# EAGLE design due_can_shield_v11 (EAGLE 6.1)
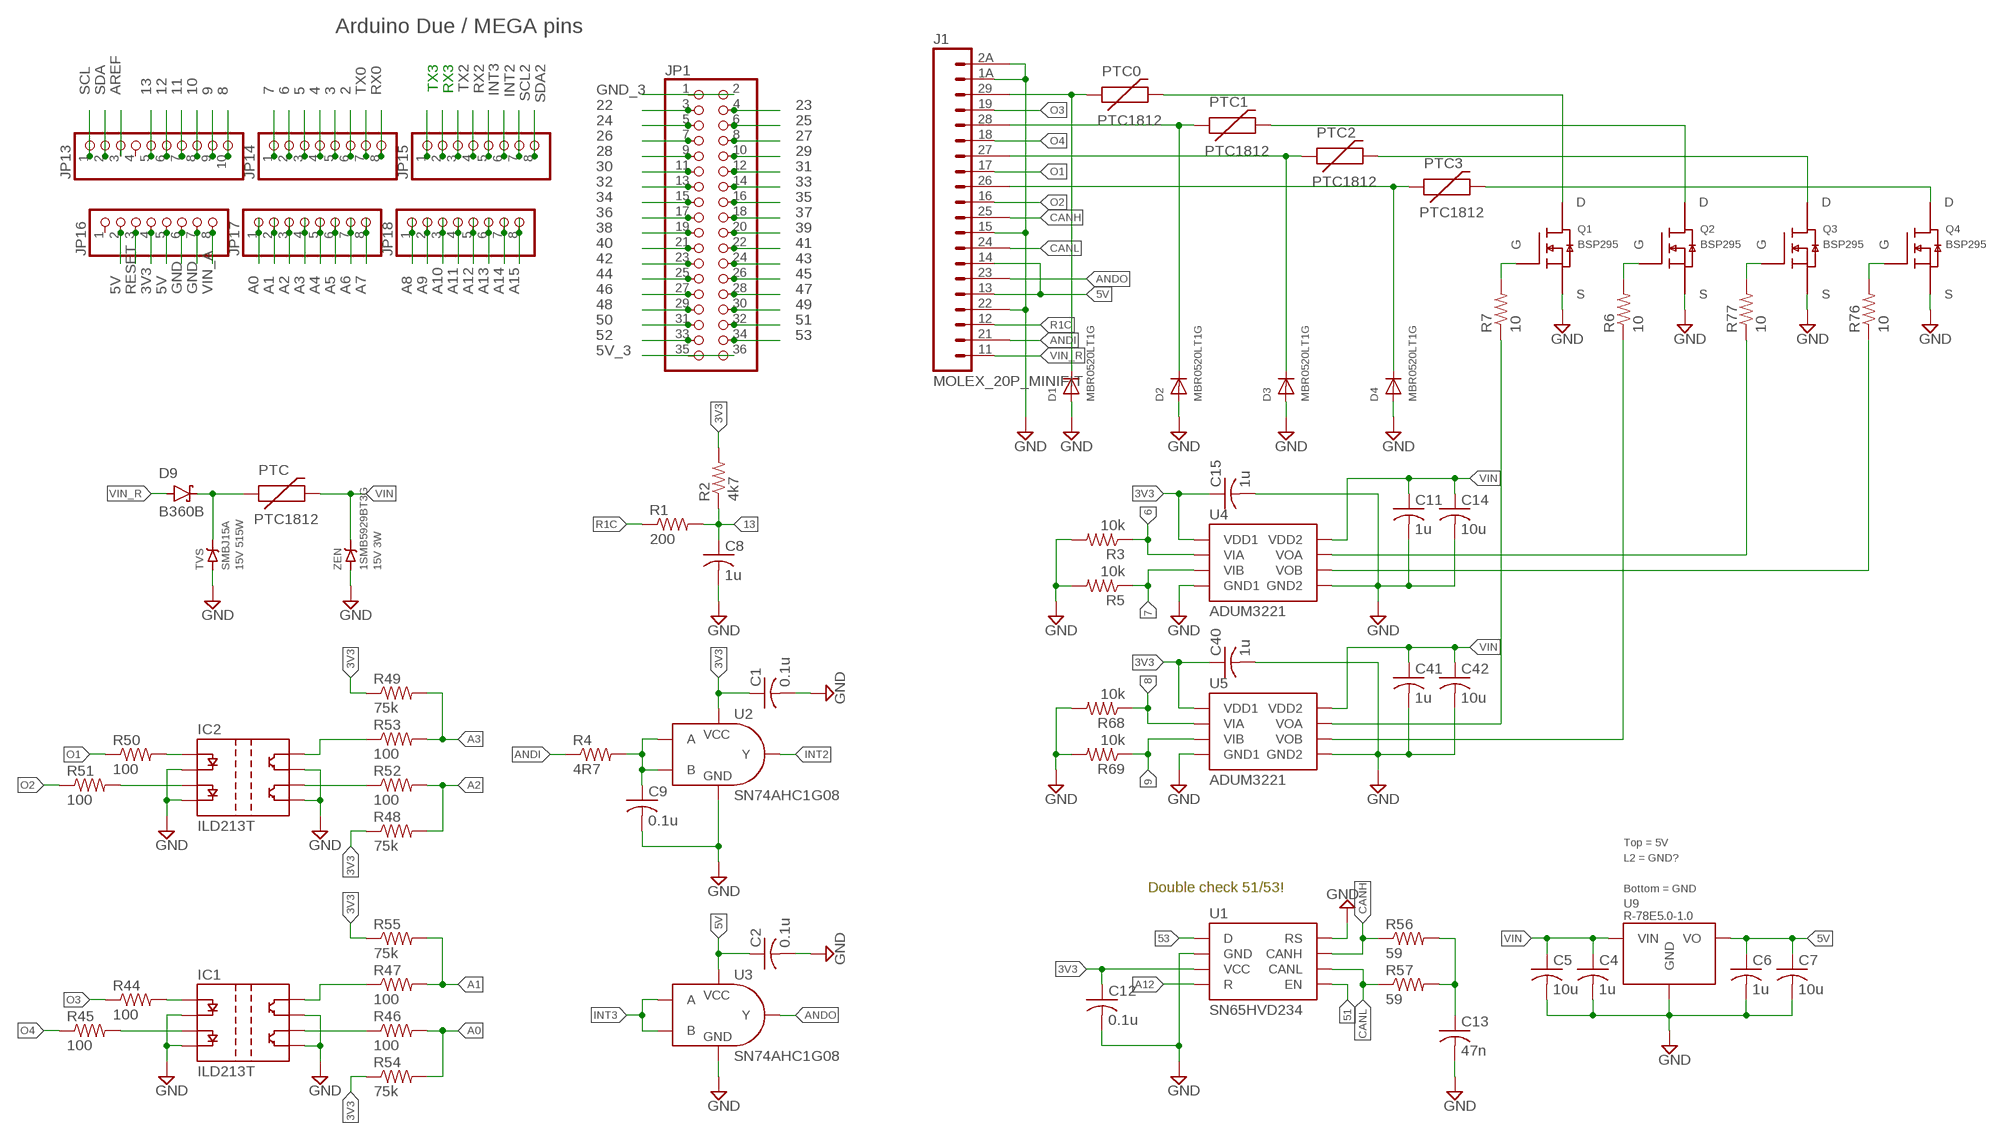
[diagram p0: schematic, sheet 1]

## Parts
C1  0.1u  C-USC0603  [C0603]
C2  0.1u  C-USC0603  [C0603]
C4  1u  C-USC0805  [C0805]
C5  10u  C-USC0805  [C0805]
C6  1u  C-USC0805  [C0805]
C7  10u  C-USC0805  [C0805]
C8  1u  C-USC0805  [C0805]
C9  0.1u  C-USC0603  [C0603]
C11  1u  C-USC0805  [C0805]
C12  0.1u  C-USC0603  [C0603]
C13  47n  C-USC0805  [C0805]
C14  10u  C-USC0805  [C0805]
C15  1u  C-USC0805  [C0805]
C40  1u  C-USC0805  [C0805]
C41  1u  C-USC0805  [C0805]
C42  10u  C-USC0805  [C0805]
D1  MBR0520LT1G  DIODESOD-123  [SOD-123]
D2  MBR0520LT1G  DIODESOD-123  [SOD-123]
D3  MBR0520LT1G  DIODESOD-123  [SOD-123]
D4  MBR0520LT1G  DIODESOD-123  [SOD-123]
D9  B360B  DIODE_SCHOTTKYSMB  [DO-214AA_SMB]
IC1  ILD213T  [8-SOIC]
IC2  ILD213T  [8-SOIC]
J1  MOLEX_20P_MINIFIT  [MOLEX_20P_MINIFIT]
JP1  PINHD-2X18  [2X18]
JP13  PINHD-1X10  [1X10]
JP14  PINHD-1X8  [1X08]
JP15  PINHD-1X8  [1X08]
JP16  PINHD-1X8  [1X08]
JP17  PINHD-1X8  [1X08]
JP18  PINHD-1X8  [1X08]
PTC  PTC1812  [1812]
PTC0  PTC1812  [1812]
PTC1  PTC1812  [1812]
PTC2  PTC1812  [1812]
PTC3  PTC1812  [1812]
Q1  BSP295  N-MOSFETSOT223  [SOT223]
Q2  BSP295  N-MOSFETSOT223  [SOT223]
Q3  BSP295  N-MOSFETSOT223  [SOT223]
Q4  BSP295  N-MOSFETSOT223  [SOT223]
R1  200  R-US_R0603  [R0603]
R2  4k7  R-US_R0603  [R0603]
R3  10k  R-US_R0402  [R0402]
R4  4R7  R-US_R0603  [R0603]
R5  10k  R-US_R0402  [R0402]
R6  10  R-US_R0402  [R0402]
R7  10  R-US_R0402  [R0402]
R44  100  R-US_R0402  [R0402]
R45  100  R-US_R0402  [R0402]
R46  100  R-US_R0402  [R0402]
R47  100  R-US_R0402  [R0402]
R48  75k  R-US_R0402  [R0402]
R49  75k  R-US_R0402  [R0402]
R50  100  R-US_R0402  [R0402]
R51  100  R-US_R0402  [R0402]
R52  100  R-US_R0402  [R0402]
R53  100  R-US_R0402  [R0402]
R54  75k  R-US_R0402  [R0402]
R55  75k  R-US_R0402  [R0402]
R56  59  R-US_R0805  [R0805]
R57  59  R-US_R0805  [R0805]
R68  10k  R-US_R0402  [R0402]
R69  10k  R-US_R0402  [R0402]
R76  10  R-US_R0402  [R0402]
R77  10  R-US_R0402  [R0402]
TVS  SMBJ15A  ZENERSMB  [DO-214AA_SMB]
U1  SN65HVD234  [8-SOIC]
U2  SN74AHC1G08  [SC70-5]
U3  SN74AHC1G08  [SC70-5]
U4  ADUM3221  [8-SOIC]
U5  ADUM3221  [8-SOIC]
U9  R-78E5.0-1.0  [R-78E5.0-1.0]
ZEN  1SMB5929BT3G  ZENERSMB  [DO-214AA_SMB]

## Nets
2: JP14.6
3: JP14.5
3V3: C1.1 C12.1 C15.1 C40.1 JP16.4 R2.2 R48.1 R49.1 R54.1 R55.1 U1.3(VCC) U2.5(VCC) U4.1(VDD1) U5.1(VDD1)
4: JP14.4
5: JP14.3
5V: C2.1 C6.1 C7.1 J1.13 J1.14 JP16.2 JP16.5 U3.5(VCC) U9.3-OUT(VO)
5V_3: JP1.36
6: JP14.2 R3.1 U4.2(VIA)
7: JP14.1 R5.1 U4.3(VIB)
8: JP13.10 R68.1 U5.2(VIA)
9: JP13.9 R69.1 U5.3(VIB)
10: JP13.8
11: JP13.7
12: JP13.6
13: C8.1 JP13.5 R1.2 R2.1
22: JP1.3
23: JP1.4
24: JP1.5
25: JP1.6
26: JP1.7
27: JP1.8
28: JP1.9
29: JP1.10
30: JP1.11
31: JP1.12
32: JP1.13
33: JP1.14
34: JP1.15
35: JP1.16
36: JP1.17
37: JP1.18
38: JP1.19
39: JP1.20
40: JP1.21
41: JP1.22
42: JP1.23
43: JP1.24
44: JP1.25
45: JP1.26
46: JP1.27
47: JP1.28
48: JP1.29
49: JP1.30
50: JP1.31
51: JP1.32 U1.5(EN)
52: JP1.33
53: JP1.34 U1.1(D)
A0: JP17.1 R46.2 R54.2
A1: JP17.2 R47.2 R55.2
A2: JP17.3 R48.2 R52.2
A3: JP17.4 R49.2 R53.2
A4: JP17.5
A5: JP17.6
A6: JP17.7
A7: JP17.8
A8: JP18.1
A9: JP18.2
A10: JP18.3
A11: JP18.4
A12: JP18.5 U1.4(R)
A13: JP18.6
A14: JP18.7
A15: JP18.8
ANDI: J1.21 R4.1
ANDO: J1.23 U3.4(Y)
AREF: JP13.3
CANH: J1.25 R56.1 U1.7(CANH)
CANL: J1.24 R57.1 U1.6(CANL)
GND: C1.2 C2.2 C4.2 C5.2 C6.2 C7.2 C8.2 C9.2 C11.2 C12.2 C13.2 C14.2 C15.2 C40.2 C41.2 C42.2 D1.A D2.A D3.A D4.A IC1.2(K1) IC1.4(K2) IC1.5(E2) IC1.7(E1) IC2.2(K1) IC2.4(K2) IC2.5(E2) IC2.7(E1) J1.1A J1.2A J1.15 J1.22 JP16.6 JP16.7 Q1.3(S) Q2.3(S) Q3.3(S) Q4.3(S) R3.2 R5.2 R68.2 R69.2 TVS.A U1.2(GND) U1.8(RS) U2.3(GND) U3.3(GND) U4.4(GND1) U4.5(GND2) U5.4(GND1) U5.5(GND2) U9.2-GND(GND) ZEN.A
GND_3: JP1.2
INT2: JP15.6 U2.4(Y)
INT3: JP15.5 U3.1(A) U3.2(B)
N$1: D1.C J1.29 PTC0.1
N$2: D2.C J1.28 PTC1.1
N$3: D3.C J1.27 PTC2.1
N$4: D4.C J1.26 PTC3.1
N$5: R77.1 U4.7(VOA)
N$6: R76.1 U4.6(VOB)
N$7: PTC0.2 Q1.2(D) Q1.4(D)
N$8: PTC1.2 Q2.2(D) Q2.4(D)
N$9: PTC2.2 Q3.2(D) Q3.4(D)
N$10: IC2.1(A1) R50.2
N$11: PTC3.2 Q4.2(D) Q4.4(D)
N$12: D9.K(CATHODE) PTC.1 TVS.K
N$13: Q1.1(G) R7.2
N$14: Q2.1(G) R6.2
N$15: Q3.1(G) R77.2
N$16: Q4.1(G) R76.2
N$17: R7.1 U5.7(VOA)
N$18: R6.1 U5.6(VOB)
N$19: IC2.3(A2) R51.2
N$20: C13.1 R56.2 R57.2
N$21: IC1.1(A1) R44.2
N$22: IC1.3(A2) R45.2
N$23: IC2.8(C1) R53.1
N$24: IC2.6(C2) R52.1
N$25: IC1.8(C1) R47.1
N$26: IC1.6(C2) R46.1
N$27: C9.1 R4.2 U2.1(A) U2.2(B)
O1: J1.17 R50.1
O2: J1.16 R51.1
O3: J1.19 R44.1
O4: J1.18 R45.1
R1C: J1.12 R1.1
RESET: JP16.3
RX0: JP14.8
RX2: JP15.4
RX3: JP15.2
SCL: JP13.1
SCL2: JP15.7
SDA: JP13.2
SDA2: JP15.8
TX0: JP14.7
TX2: JP15.3
TX3: JP15.1
VIN: C4.1 C5.1 C11.1 C14.1 C41.1 C42.1 PTC.2 U4.8(VDD2) U5.8(VDD2) U9.1-IN(VIN) ZEN.K
VIN_A: JP16.8
VIN_R: D9.A(ANODE) J1.11
Unconnected: JP1.1 JP1.35 JP13.4 JP16.1

## Notes on the sheet
- Arduino Due / MEGA pins
- 15V 515W | 15V 3W
- Top = 5V
- L2 = GND?
- Double check 51/53! | Bottom = GND

## Library data of the parts
C1 C2 C4-C9 C11-C15 C40-C42 = resistor:C-US: CAPACITOR, American symbol
D1-D4 = adafruit:DIODE: Diode SMADIODE - SMA Surface Mount Package 20V 1A Schottky Diode Digikey: 641-1014-6-ND DO-1N4148 - Through Hole Small Current Diode SOD-123 20V 1 A (.5mV Vf) Schottky Diode - Digikey: MBRX120TPMSCT-ND SOD-323 10V 570mA (.38mV Vf, 3ns) Schottky Diode - Digikey: ZLLS410CT-ND SOD-523 30V 30mA Schottky Diode (RB751S-40TE61) - Digikey: RB751S-40TE61CT-ND SOT23-R/W - SOT23 Package (R = Solder Paste/Reflow Ovens, W = Hand-Soldering) BAT54Film 40V 300mA - Digikey: 497-7162-1-ND
D9 = custom:DIODE_SCHOTTKY: 40V 1A 500mV @1A
IC1 IC2 = custom:ILD213T: Optocoupler Dual Phototransistor Output 4kV 70V 30mA Max
J1 = custom:MOLEX_20P_MINIFIT: Molex 353182020
JP1 = pinhead:PINHD-2X18: PIN HEADER
JP13 = pinhead:PINHD-1X10: PIN HEADER
JP14-JP18 = pinhead:PINHD-1X8: PIN HEADER
PTC PTC0 PTC1-PTC3 = custom:PTC
Q1-Q4 = custom:N-MOSFET: N-Channel MOSFET - HM2302A, Vds 20V, Id 2.9A, Rdson 59mOhm @2.5Vgs, Marking Code = A2SHB
R1-R7 R44-R57 R68 R69 R76 R77 = resistor:R-US_: RESISTOR, American symbol
TVS ZEN = custom:ZENER
U1 = custom:SN65HVD234: CAN Transceiver 3.3V 1Mbps -7-12Vcm 5V Tolerant
U2 U3 = custom:SN74AHC1G08: AND Gate Single 2-Input Positive 2-5.5V
U4 U5 = custom:ADUM3221: Gate Driver Isolated Dual Channel 4A 2500V 3.3-5Vin 4.5-18Vout
U9 = custom:R-78E5.0-1.0: Voltage Regulator Module 8-28V Input 5.0V 1.0A Output 91% Eff@Vinmin

## Net classes
1 vcc: width 0.305 mm

## Board
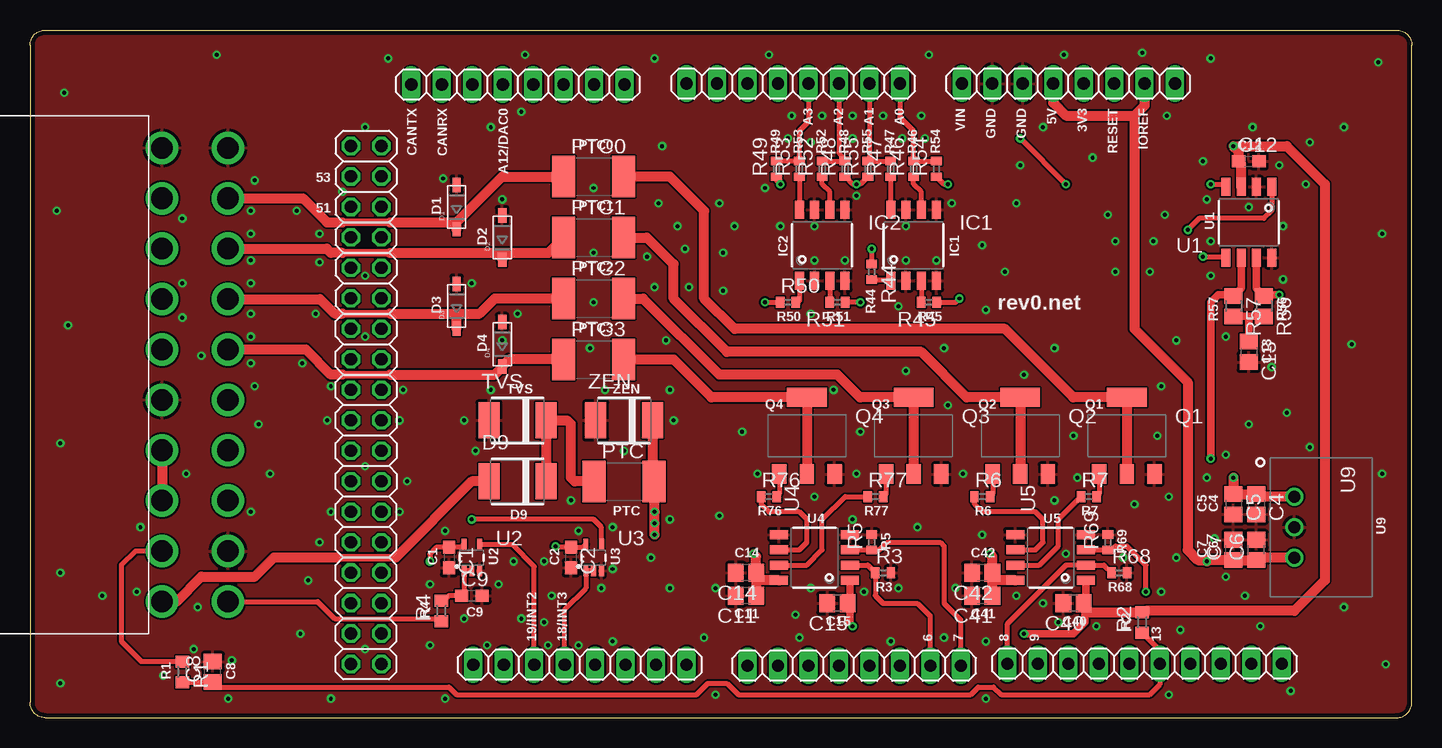
[diagram p1: board, top side]
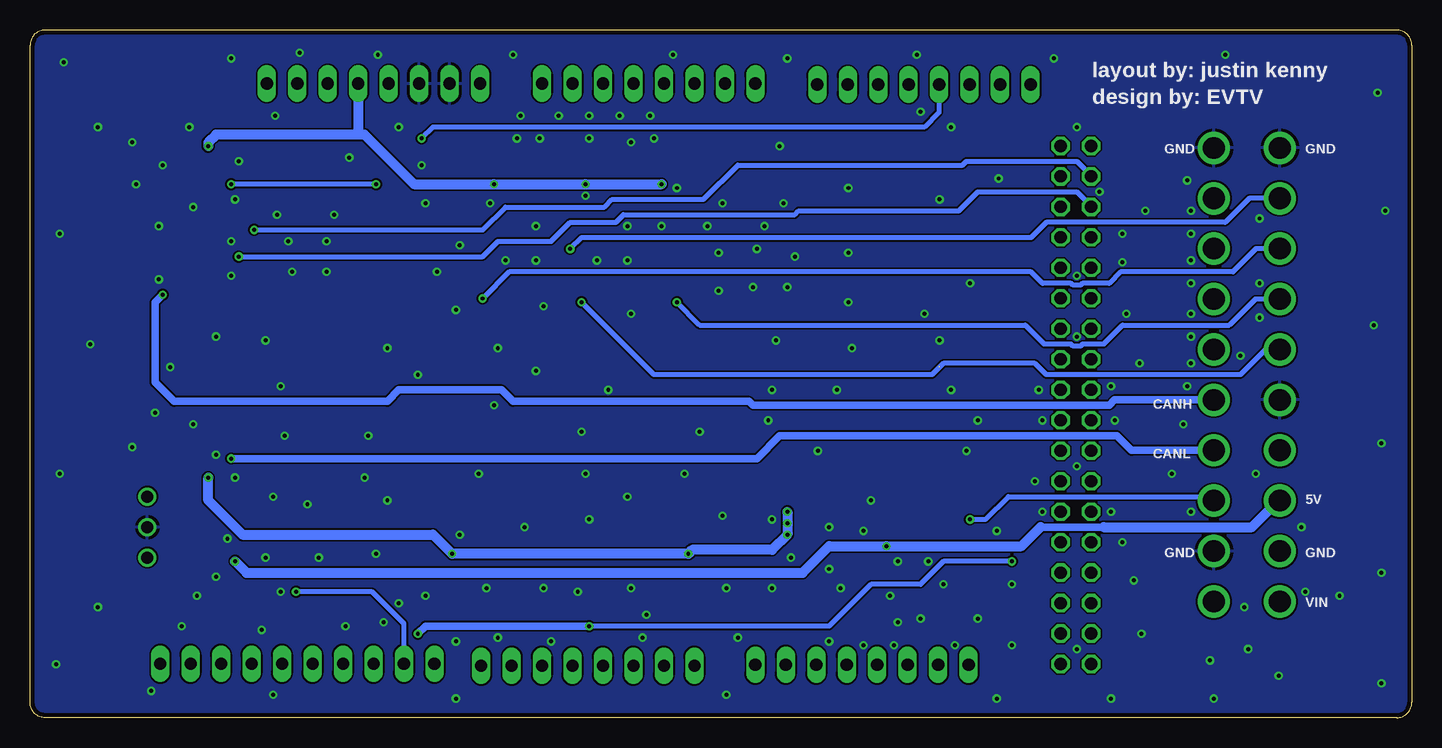
[diagram p2: board, bottom side, seen from below]

Size 115.2 x 57.3 mm. Coordinates in mm from the lower left corner, seen from the top.
Outline: 0,56.03 0,1.27 arc90 1.27,0 113.93,0 arc90 115.2,1.27 115.2,56.03 arc90 113.93,57.3 1.27,57.3 arc90 0,56.03
Copper layers (1*16): Top 0.0356mm / dielectric 1.5011mm / Bottom 0.0356mm
Design rules: minimum track width 6mil, minimum drill 13mil, track to track 6mil, track to pad 6mil, pad to pad 6mil, via to via 6mil, smd to smd 6mil, copper to edge 15mil, drill to drill 6mil, minimum pad ring 7mil, minimum via ring 7mil, stop-mask expansion 2.5mil, vias tented up to drill 14mil, thermal gap 10mil

### Footprints (pad centres in the part's own frame; a part is rotated, then mirrored left to right if it is on the bottom)
C0603 = smd 1.1 x 1: 1 -0.85,0; 2 0.85,0
C0805 = smd 1.3 x 1.5: 1 -0.85,0; 2 0.85,0
SOD-123 = smd 1.2 x 0.7: A 1.85,0; C -1.85,0
DO-214AA_SMB = smd 1.75 x 3: A -2.375,0; K 2.375,0
8-SOIC = smd 0.75 x 1.5: 1 -1.905,-2.95; 2 -0.635,-2.95; 3 0.635,-2.95; 4 1.905,-2.95; 5 1.905,2.95; 6 0.635,2.95; 7 -0.635,2.95; 8 -1.905,2.95
MOLEX_20P_MINIFIT = drill 1.8: 1A -18.9,-5.5; 2A -18.9,0; 11 18.9,-5.5; 12 14.7,-5.5; 13 10.5,-5.5; 14 6.3,-5.5; 15 2.1,-5.5; 16 -2.1,-5.5; 17 -6.3,-5.5; 18 -10.5,-5.5; 19 -14.7,-5.5; 21 18.9,0; 22 14.7,0; 23 10.5,0; 24 6.3,0; 25 2.1,0; 26 -2.1,0; 27 -6.3,0; 28 -10.5,0; 29 -14.7,0
2X18 = drill 1.016 octagon: 1 -21.59,-1.27; 2 -21.59,1.27; 3 -19.05,-1.27; 4 -19.05,1.27; 5 -16.51,-1.27; 6 -16.51,1.27; 7 -13.97,-1.27; 8 -13.97,1.27; 9 -11.43,-1.27; 10 -11.43,1.27; 11 -8.89,-1.27; 12 -8.89,1.27; 13 -6.35,-1.27; 14 -6.35,1.27; 15 -3.81,-1.27; 16 -3.81,1.27; 17 -1.27,-1.27; 18 -1.27,1.27; 19 1.27,-1.27; 20 1.27,1.27; 21 3.81,-1.27; 22 3.81,1.27; 23 6.35,-1.27; 24 6.35,1.27; 25 8.89,-1.27; 26 8.89,1.27; 27 11.43,-1.27; 28 11.43,1.27; 29 13.97,-1.27; 30 13.97,1.27; 31 16.51,-1.27; 32 16.51,1.27; 33 19.05,-1.27; 34 19.05,1.27; 35 21.59,-1.27; 36 21.59,1.27
1X10 = drill 1.016 long: 1 -11.43,0; 2 -8.89,0; 3 -6.35,0; 4 -3.81,0; 5 -1.27,0; 6 1.27,0; 7 3.81,0; 8 6.35,0; 9 8.89,0; 10 11.43,0
1X08 = drill 1.016 long: 1 -8.89,0; 2 -6.35,0; 3 -3.81,0; 4 -1.27,0; 5 1.27,0; 6 3.81,0; 7 6.35,0; 8 8.89,0
1812 = smd 1.9 x 3.45: 1 -2.5,0; 2 2.5,0
SOT223 = smd 1.2 x 1.6: 1 -2.3,-3.2; 2 0,-3.2; 3 2.3,-3.2 | smd 3.3 x 1.6: 4 0,3.2
R0603 = smd 1 x 1.1: 1 -0.85,0; 2 0.85,0
R0402 = smd 0.7 x 0.9: 1 -0.65,0; 2 0.65,0
R0805 = smd 1.3 x 1.5: 1 -0.85,0; 2 0.85,0
SC70-5 = smd 0.4 x 0.9: 1 -0.65,-1.1; 2 0,-1.1; 3 0.65,-1.1; 4 0.65,1.1; 5 -0.65,1.1
R-78E5.0-1.0 = drill 1: 1-IN -2.54,0; 2-GND 0,0; 3-OUT 2.54,0

### Placement (x,y rotation side)
C1  34.92,13.34 270 top
C2  45.09,13.34 270 top
C4  102.23,17.78 270 top
C5  100.33,17.78 270 top
C6  102.23,13.97 90 top
C7  100.33,13.97 90 top
C8  15.24,3.81 90 top
C9  36.83,10.16 0 top
C11  59.69,10.16 180 top
C12  101.6,46.35 0 top
C13  101.6,30.48 270 top
C14  59.69,12.06 180 top
C15  67.31,9.53 180 top
C40  87,9.53 180 top
C41  79.38,10.16 180 top
C42  79.38,12.06 180 top
D1  35.56,42.55 90 top
D2  39.37,40.01 90 top
D3  35.56,34.29 90 top
D4  39.37,31.11 90 top
D9  40.64,19.68 0 top
IC1  73.66,39.37 0 top
IC2  66.04,39.37 0 top
J1  16.51,28.57 270 top
JP1  28.02,26.05 90 top
JP13  92.92,4.5 180 top
JP14  68.7,4.33 180 top
JP15  45.85,4.41 180 top
JP16  86.57,52.84 180 top
JP17  63.62,52.84 180 top
JP18  40.68,52.75 180 top
PTC  49.53,19.68 0 top
PTC0  46.99,45.09 0 top
PTC1  46.99,40.01 0 top
PTC2  46.99,34.92 0 top
PTC3  46.99,29.84 0 top
Q1  91.44,23.5 0 top
Q2  82.55,23.5 0 top
Q3  73.66,23.5 0 top
Q4  64.77,23.5 0 top
R1  12.7,3.81 270 top
R2  92.71,7.94 90 top
R3  71.12,12.06 0 top
R4  34.29,8.89 90 top
R5  70.17,14.61 90 top
R6  79.38,18.41 0 top
R7  88.27,18.41 0 top
R44  70.17,37.15 270 top
R45  74.93,34.61 180 top
R46  73.66,45.72 90 top
R47  71.75,45.72 90 top
R48  67.94,45.72 90 top
R49  62.23,45.72 90 top
R50  63.18,34.61 0 top
R51  67.31,34.61 180 top
R52  66.04,45.72 90 top
R53  64.14,45.72 90 top
R54  75.56,45.72 90 top
R55  69.85,45.72 90 top
R56  102.87,34.29 270 top
R57  100.33,34.29 270 top
R68  90.81,12.06 0 top
R69  89.85,14.61 90 top
R76  61.59,18.41 0 top
R77  70.48,18.41 0 top
TVS  40.64,24.77 0 top
U1  101.6,41.27 180 top
U2  36.83,13.34 0 top
U3  46.99,13.34 0 top
U4  65.41,13.34 90 top
U5  85.09,13.34 90 top
U9  105.41,15.88 270 top
ZEN  49.53,24.77 0 top

### Tracks (layer width: path | path; a pad name or v marks a point on that pad's centre or on a via)
3V3  (via drill 0.33)
  Top 0.406: R55.1 69.22,44.45 v68.9,44.45 68.58,44.45 67.96,45.07 R48.1 | 88.27,8.79 C40.1 | U2.5 35.93,14.19 C1.1 33.87,14.19 33.34,13.65 v33.34,13.02 | R49.1 62.23,44.77 v62.55,44.45 | R54.1 75.58,45.07 76.2,44.45 v76.52,44.45
  Top 0.61: U4.1 68.36,9.94 | 68.36,9.94 67.94,9.53 C15.1 | U5.1 88.04,9.72 C40.1 | 68.36,9.94 68.36,7.84 v68.58,7.62 | v82.87,6.99 87,6.99 87.95,7.94 87.95,8.79 88.27,8.79
  Top 0.813: U1.3 100.97,46.14 C12.1 100.75,47.2 v100.33,47.62 104.78,47.62 107.95,44.45 107.95,11.43 105.41,8.89 93.03,8.89 92.81,8.79 R2.2 88.27,8.79
  Bottom 0.406: v33.34,13.02 39.05,13.02 40.96,11.11 45.09,11.11 48.58,7.62 v68.58,7.62
  Bottom 0.61: v68.58,7.62 82.23,7.62 v82.87,6.99
  Bottom 0.813: 87.95,48.58 87.31,48.58 83.19,44.45 v76.52,44.45 v68.9,44.45 v62.55,44.45 | 87.95,48.58 99.69,48.58 100.33,47.94 v100.33,47.62 | JP16.4 87.84,48.69 87.95,48.58
5V  (via drill 0.33)
  Top 0.406: U3.5 46.09,14.19 C2.1 43.92,14.19 v43.81,14.29
  Top 0.813: U9.3-OUT 102.45,13.34 C6.1 C7.1 98.21,13.12 v98.11,13.02 98,13.12 97.37,13.12 96.52,13.97 96.52,27.94 92.08,32.38 92.08,50.16 | JP16.2 92.92,51.01 92.08,50.16 | JP16.5 85.3,51.23 86.36,50.16 92.08,50.16 | J1.14 J1.13
  Bottom 0.61: 30.96,15.88 25.72,15.88
  Bottom 0.813: v98.11,13.02 97.16,12.06 50.8,12.06 48.58,14.29 v43.81,14.29 32.54,14.29 30.96,15.88 | 25.72,15.88 13.34,15.88 11.13,18.07 J1.13
6
  Top 0.406: U4.2 69.83,12.7 R3.1 70.47,10.18 71.12,9.53 73.98,9.53 75.05,8.45 JP14.2
7
  Top 0.406: U4.3 69.83,13.97 R5.1 70.2,13.98 70.82,13.98 71.44,14.61 75.88,14.61 76.2,14.29 76.2,9.53 77.59,8.13 JP14.1
8
  Top 0.406: R68.1 89.53,12.7 U5.2 86.36,12.7 81.48,7.83 JP13.10
9  (via drill 0.33)
  Top 0.406: U5.3 89.52,13.97 R69.1 89.87,13.97 90.17,13.97 90.49,14.29 91.44,14.29 93.03,12.7 v93.03,10.48
  Bottom 0.406: JP13.9 84.03,7.83 86.68,10.48 v93.03,10.48
13
  Top 0.406: R1.2 C8.1 15.24,2.54 34.92,2.54 35.56,1.91 55.56,1.91 56.52,2.86 58.1,2.86 59.05,1.91 78.42,1.91 79.06,2.54 80.33,2.54 80.96,1.91 93.34,1.91 94.19,2.75 JP13.5 94.19,5.61 R2.1
51  (via drill 0.33)
  Top 0.406: v97.79,38.42 99.6,38.42 U1.5
  Bottom 0.406: v97.79,38.42 77.47,38.42 76.2,39.69 71.75,39.69 70.17,41.27 66.36,41.27 65.72,41.91 51.44,41.91 51.12,42.23 37.78,42.23 36.2,43.81 27.94,43.81 26.66,42.53 JP1.32
53  (via drill 0.33)
  Top 0.406: U1.1 103.5,42.23 102.87,41.59 97.47,41.59 v96.52,40.64
  Bottom 0.406: v96.52,40.64 77.47,40.64 75.56,42.55 67.31,42.55 66.67,43.18 59.05,43.18 56.2,46.04 37.47,46.04 37.15,46.35 27.94,46.35 26.66,45.07 JP1.34
A0
  Top 0.406: R54.2 R46.2 73.66,48.9 72.51,50.04 JP17.1
A1
  Top 0.406: R47.2 R55.2 69.97,46.69 JP17.2
A2
  Top 0.406: R52.2 R48.2 67.43,47.08 JP17.3
A3
  Top 0.406: R49.2 R53.2 64.14,48.9 64.89,49.65 JP17.4
A12  (via drill 0.33)
  Top 0.406: v82.55,48.26 v86.36,44.45 | v98.42,44.45 99.47,44.45 U1.4
  Bottom 0.406: JP18.5 39.41,50.44 40.64,49.21 81.6,49.21 v82.55,48.26 | v86.36,44.45 v98.42,44.45
ANDI
  Top 0.406: J1.21 23.98,9.68 25.4,8.26 34.08,8.26 R4.1
ANDO  (via drill 0.33)
  Top 0.406: U3.4 47.64,15.86 46.99,16.51 v36.83,16.51
  Bottom 0.406: v36.83,16.51 35.56,16.51 33.66,18.41 16.85,18.41 J1.23
CANH  (via drill 0.33)
  Top 0.61: U1.7 102.23,35.77 R56.1 102.97,35.24 v104.14,35.24
  Bottom 0.61: J1.25 24.8,26.48 25.24,26.04 54.93,26.04 55.24,26.35 74.93,26.35 75.88,27.3 84.45,27.3 85.41,26.35 103.19,26.35 104.78,27.94 104.78,34.61 v104.14,35.24
CANL  (via drill 0.33)
  Top 0.61: U1.6 100.97,35.77 R57.1 100.23,35.24 99.06,35.24 98.42,34.61 v98.42,21.59
  Bottom 0.61: J1.24 23.39,22.27 24.61,23.5 52.7,23.5 54.61,21.59 v98.42,21.59
GND  (via drill 0.33)
  other vias: 18.41,17.14 25.08,17.14 30.8,17.14 18.73,27.62 25.08,27.62 40.32,13.02 42.86,13.02 48.58,12.38 53.34,10.79 57.15,10.79 65.09,10.79 69.53,10.48 72.39,10.79 77.15,10.79 82.23,10.16 84.45,9.53 85.72,7.94 88.9,7.62 94.3,10.48 99.69,11.75 101.28,10.16 102.55,7.62 98.74,14.92 95.57,13.34 91.12,13.34 86.36,13.65 57.15,1.91 79.69,1.59 34.61,1.59 25.08,1.59 16.51,1.59 11.11,3.49 13.65,5.71 16.83,4.76 27.94,5.71 13.97,9.21 8.89,10.48 6.03,10.16 9.21,15.88 13.02,20.32 20,20.32 19.05,24.45 24.77,24.77 27.94,20.95 36.2,24.77 30.8,24.77 31.11,27.3 22.7,29.53 18.41,29.53 14.29,30.16 12.7,33.34 12.7,36.2 18.41,33.66 23.81,33.66 27.94,31.75 18.41,31.75 18.41,36.2 27.94,36.83 24.13,37.94 18.41,38.1 18.41,40.32 24.13,40.32 22.23,42.23 18.41,42.23 12.7,41.59 18.73,44.77 26.04,43.81 27.94,49.21 34.45,44.93 39.37,43.18 36.83,36.2 40.64,33.66 39.37,31.43 46.67,30.8 46.99,34.61 46.99,38.73 46.99,44.13 40.96,50.48 38.42,49.21 63.5,50.16 63.18,48.26 65.09,47.94 66.04,50.16 68.58,48.26 68.58,50.16 71.12,50.16 72.71,48.26 74.3,50.16 74.61,48.26 68.9,43.5 62.55,40.96 65.41,40.96 73.03,40.96 76.83,42.86 73.03,38.1 75.56,38.1 67.94,38.1 65.41,38.1 65.09,33.66 72.39,34.29 57.78,35.56 54.93,35.88 54.61,39.05 52.39,42.86 51.44,38.42 52.07,35.88 53.02,31.43 66.99,27.3 73.03,28.89 76.2,30.8 82.87,28.57 68.9,20.32 77.79,20.32 60.64,20.32 53.66,24.77 53.34,16.51 49.53,22.23 45.09,18.1 51.75,13.34 48.58,6.35 56.2,6.67 64.14,6.67 63.82,8.57 71.75,6.35 76.2,6.67 73.98,15.88 79.38,15.24 79.69,6.35 95.89,7.3 94.93,1.91 105.09,2.22 113.03,4.45 109.54,9.21 112.71,20.32 110.17,31.11 112.71,40.32 112.39,54.61 98.42,54.93 109.54,49.21 97.79,46.35 104.14,46.04 104.46,40.96 94.61,41.91 95.57,31.43 89.85,41.91 88.58,46.67 84.45,49.21 82.55,46.04 82.23,42.86 94.3,27.62 85.41,30.8 79.69,33.97 52.7,47.62 74.93,55.24 52.07,54.93 61.59,55.24 41.27,55.24 29.84,54.93 15.56,55.24 2.86,52.07 2.22,42.23 3.17,32.7 2.54,22.86 2.54,2.86 22.54,6.99 23.18,11.43 37.15,22.23 34.61,15.56 45.72,15.56 48.58,15.88 39.05,11.11 33.34,11.11 36.2,8.26 40.96,8.26 42.86,7.94 43.18,6.03 45.72,6.03 43.5,10.16 47.62,10.79 38.1,6.03 33.34,6.03 57.47,16.83 47.94,27.3 85.41,18.1 87.31,20 94.93,18.41 92.08,17.78 68.58,16.51 65.41,18.41 76.52,26.04 101.6,24.45 99.69,21.91 104.78,25.4 103.5,29.21 99.69,31.75 98.42,36.83 104.46,36.51 98.42,39.69 98.11,43.18 101.6,42.55 101.92,49.21 106.68,47.94 106.36,44.45 106.68,22.54 98.11,20 61.28,44.13 57.47,42.86 53.98,40.96 58.74,40.96 57.78,38.73 79.38,39.37 90.49,39.69 90.49,37.15 81.28,37.15 93.66,39.69 93.34,37.15 87,23.5 93.98,23.5 69.22,23.81 59.37,23.81 53.34,27.3 31.43,19.68 38.42,27.3 24.13,14.61 2.54,12.06 94.77,50.16 86.2,55.24 92.71,55.4
  pour Top: 0,57.15 115.57,57.15 115.57,0 0,0
  pour Bottom: 0,57.15 115.57,57.15 115.57,0 0,0
INT2
  Top 0.406: U2.4 40.17,14.44 42.03,12.57 JP15.6
INT3
  Top 0.406: U3.2 U3.1 46.34,10.78 44.58,9.02 JP15.5
N$1
  Top 0.61: 26.04,41.27 30,41.27
  Top 0.813: J1.29 22.77,43.27 24.77,41.27 26.04,41.27 | 30,41.27 35.56,41.27 | 35.56,41.27 39.37,45.09 PTC0.1 | D1.C 35.56,41.27
N$2
  Top 0.61: 30,38.73 26.04,38.73
  Top 0.813: J1.28 24.74,39.08 25.08,38.73 26.04,38.73 | 30,38.73 39.37,38.73 | 39.37,38.73 43.22,38.73 PTC1.1 | D2.C 39.37,38.73
N$3
  Top 0.61: 26.04,33.66 30,33.66
  Top 0.813: J1.27 24.18,34.88 25.4,33.66 26.04,33.66 | 30,33.66 35.56,33.66 | 35.56,33.66 37.47,33.66 38.73,34.92 PTC2.1 | D3.C 35.56,33.66
N$4  (1 unrouted)
  Top 0.61: 30,28.57 26.04,28.57
  Top 0.813: J1.26 22.98,30.68 25.08,28.57 26.04,28.57 | 30,28.57 38.73,28.57 39.37,29.21 | PTC3.1 39.95,29.84 D4.C
N$5
  Top 0.406: U4.7 64.77,12.7 66.04,13.97 66.04,16.51 67.94,18.41 R77.1
N$6
  Top 0.406: U4.6 64.14,13.97 64.77,14.61 64.77,16.51 64.14,17.14 61.59,17.14 60.95,17.8 R76.1
N$7
  Top 0.813: PTC0.2 53.34,45.09 56.2,42.23 56.2,34.92 58.74,32.38 81.28,32.38 86.97,26.7 Q1.4 Q1.2
N$8
  Top 0.813: PTC1.2 51.44,40.01 53.66,37.78 53.66,34.92 58.1,30.48 74.3,30.48 78.08,26.7 Q2.4 Q2.2
N$9
  Top 0.813: PTC2.2 51.12,34.92 57.47,28.57 67.31,28.57 69.19,26.7 Q3.4 Q3.2
N$10
  Top 0.406: IC2.1 64.14,34.71 R50.2
N$11
  Top 0.813: PTC3.2 53.66,29.84 56.81,26.7 Q4.4 Q4.2
N$12
  Top 0.813: D9.K TVS.K 44.77,24.77 45.09,24.45 45.09,20 45.4,19.68 PTC.1
N$13
  Top 0.406: Q1.1 89.14,18.64 R7.2
N$14
  Top 0.406: Q2.1 80.25,18.64 R6.2
N$15
  Top 0.406: Q3.1 71.36,18.64 R77.2
N$16
  Top 0.406: Q4.1 62.47,18.64 R76.2
N$17
  Top 0.406: U5.7 84.14,12.7 85.72,14.29 85.72,16.51 87,17.78 87,17.8 R7.1
N$18
  Top 0.406: U5.6 83.82,13.97 84.45,14.61 84.45,16.51 83.82,17.14 79.38,17.14 78.74,17.78 78.74,18.4 R6.1
N$19
  Top 0.406: IC2.3 66.67,34.92 66.57,34.71 R51.2
N$20
  Top 0.61: R57.2 101.6,33.44 | 101.6,33.44 R56.2 | C13.1 101.6,33.44
N$21
  Top 0.406: 71.65,36.3 71.75,36.51 IC1.1 71.68,36.5 R44.2
N$22
  Top 0.406: IC1.3 74.3,34.71 R45.2
N$23
  Top 0.406: R53.1 IC2.8
N$24
  Top 0.406: IC2.6 66.67,43.81 66.04,44.45 R52.1
N$25
  Top 0.406: IC1.8 R47.1
N$26
  Top 0.406: IC1.6 74.3,43.81 73.66,44.45 R46.1
N$27
  Top 0.406: U2.2 U2.1 36.18,10.36 C9.1 34.92,10.16 34.29,9.53 R4.2
O1  (via drill 0.33)
  Top 0.406: v61.28,34.61 R50.1
  Bottom 0.406: J1.17 13.07,34.88 15.24,32.7 24.13,32.7 25.72,31.11 27.46,31.11 27.62,30.96 28.26,30.96 28.42,31.11 30.64,31.11 32.23,32.7 59.37,32.7 v61.28,34.61
O2  (via drill 0.33)
  Top 0.406: v69.22,34.61 R51.1
  Bottom 0.406: J1.16 12.19,30.68 14.29,28.57 30.48,28.57 31.43,29.53 39.05,29.53 40.01,28.57 63.18,28.57 v69.22,34.61
O3  (via drill 0.33)
  Top 0.406: R44.1 v70.17,39.05
  Bottom 0.406: J1.19 13.56,43.27 15.56,41.27 30.48,41.27 31.75,40.01 69.22,40.01 v70.17,39.05
O4  (via drill 0.33)
  Top 0.406: R45.1 77.15,34.61 v77.47,34.92
  Bottom 0.406: J1.18 12.99,39.08 14.92,37.15 24.29,37.15 25.24,36.2 27.46,36.2 27.62,36.04 28.26,36.04 28.42,36.2 30.8,36.2 31.75,37.15 75.25,37.15 v77.47,34.92
R1C
  Top 0.406: J1.12 8.79,13.88 7.62,12.7 7.62,6.35 9.31,4.66 R1.1
VIN  (via drill 0.33)
  Top 0.406: 80.22,10.58 80.01,10.16 C41.1 | C11.1 60.64,10.16
  Top 0.813: U9.1-IN 102.45,18.41 C4.1 C5.1 v100.33,20 | ZEN.K 51.91,19.81 PTC.2 52.03,15.28 v52.07,15.24 v52.07,16.19 v52.07,17.14 | 60.54,11.43 C14.1 60.54,13.44 v60.33,13.65 | 60.54,11.43 60.54,10.26 60.64,10.16 | U4.8 60.54,11.43 | 80.22,10.58 80.22,11.43 | 80.22,11.43 C42.1 80.22,13.44 v80.01,13.65 | U5.8 80.22,11.43
  Bottom 0.813: v52.07,17.14 v52.07,15.24 53.34,13.97 60.01,13.97 v60.33,13.65 v80.01,13.65 81.6,15.24 97.47,15.24 100.33,18.1 v100.33,20
VIN_R
  Top 0.61: 30.48,13.34 25.72,13.34
  Top 0.813: D9.A 36.83,19.68 30.48,13.34 | 25.72,13.34 20.32,13.34 18.73,11.75 14.29,11.75 12.21,9.68 J1.11

### Text on the board
tPlace: CANTX | CANRX | A12/DAC0 | A3 | A2 | A1 | A0 | VIN | GND | GND | 5V | 3V3 | RESET | IOREF | PTC0 | R49 | R53 | R52 | R48 | R55 | R47 | R46 | R54 | C12 | 53 | 51 | D1 | PTC1 | U1 | D2 | IC2 | IC1 | PTC2 | D3 | R44 | rev0.net | R50 | R51 | R45 | R57 | R56 | PTC3 | D4 | C13 | TVS | ZEN | Q4 | Q3 | Q2 | Q1 | D9 | PTC | R76 | R77 | R6 | R7 | C5 | C4 | U4 | U5 | U9 | R5 | R69 | C1 | U2 | C2 | U3 | C14 | C42 | C7 | C6 | R3 | R68 | C9 | R4 | C11 | C15 | C41 | C40 | R2 | 19/INT2 | 18/INT3 | 6 | 7 | 8 | 9 | 13 | R1 | C8
bPlace: layout by: justin kenny | design by: EVTV | GND | GND | CANH | CANL | 5V | GND | GND | VIN
tStop: HPEV LLC | 2020